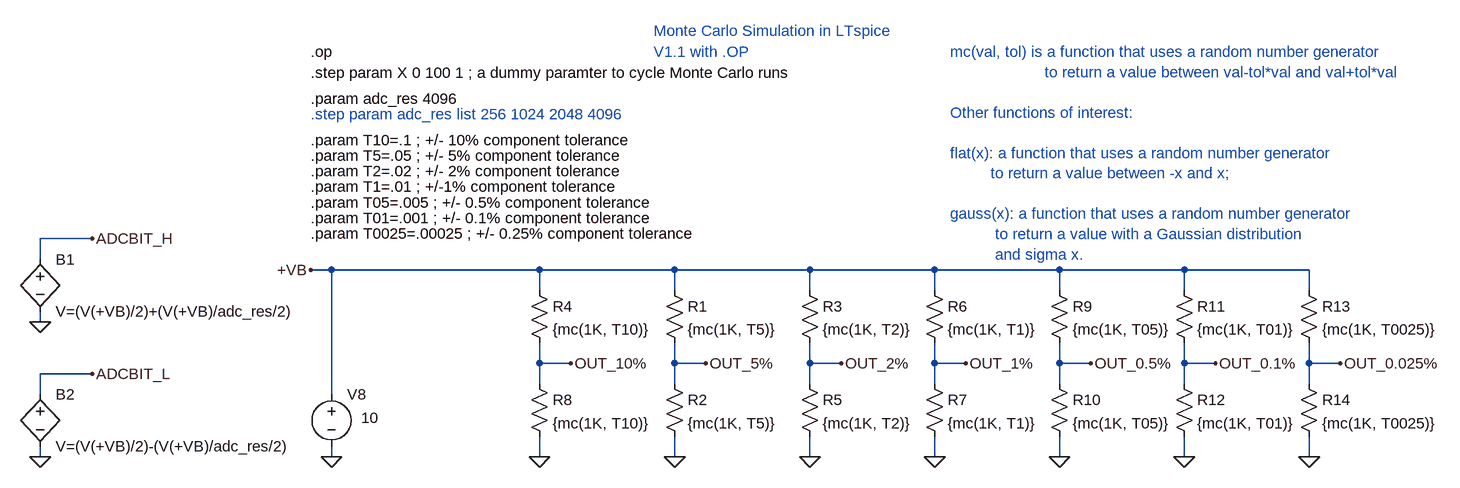
[diagram p0: schematic Voltage Divider Tol vs ADC Resolution V1.1.asc]
Voltage Divider Tol vs ADC Resolution V1.1.asc, the LTspice schematic file:
Version 4
SHEET 1 1944 2380
WIRE -2032 784 -2112 784
WIRE -2112 816 -2112 784
WIRE -1664 832 -1696 832
WIRE -1344 832 -1664 832
WIRE -1136 832 -1344 832
WIRE -928 832 -1136 832
WIRE -736 832 -928 832
WIRE -544 832 -736 832
WIRE -352 832 -544 832
WIRE -160 832 -352 832
WIRE -1344 864 -1344 832
WIRE -1136 864 -1136 832
WIRE -928 864 -928 832
WIRE -736 864 -736 832
WIRE -544 864 -544 832
WIRE -352 864 -352 832
WIRE -160 864 -160 832
WIRE -2112 912 -2112 896
WIRE -1344 976 -1344 944
WIRE -1296 976 -1344 976
WIRE -1136 976 -1136 944
WIRE -1088 976 -1136 976
WIRE -928 976 -928 944
WIRE -880 976 -928 976
WIRE -736 976 -736 944
WIRE -688 976 -736 976
WIRE -544 976 -544 944
WIRE -496 976 -544 976
WIRE -352 976 -352 944
WIRE -304 976 -352 976
WIRE -160 976 -160 944
WIRE -112 976 -160 976
WIRE -2032 992 -2112 992
WIRE -1344 1008 -1344 976
WIRE -1136 1008 -1136 976
WIRE -928 1008 -928 976
WIRE -736 1008 -736 976
WIRE -544 1008 -544 976
WIRE -352 1008 -352 976
WIRE -160 1008 -160 976
WIRE -2112 1024 -2112 992
WIRE -1664 1024 -1664 832
WIRE -2112 1120 -2112 1104
WIRE -1664 1120 -1664 1104
WIRE -1344 1120 -1344 1088
WIRE -1136 1120 -1136 1088
WIRE -928 1120 -928 1088
WIRE -736 1120 -736 1088
WIRE -544 1120 -544 1088
WIRE -352 1120 -352 1088
WIRE -160 1120 -160 1088
FLAG -1696 832 +VB
FLAG -1664 1120 0
FLAG -1344 1120 0
FLAG -1296 976 OUT_10%
FLAG -1136 1120 0
FLAG -1088 976 OUT_5%
FLAG -928 1120 0
FLAG -880 976 OUT_2%
FLAG -736 1120 0
FLAG -688 976 OUT_1%
FLAG -544 1120 0
FLAG -496 976 OUT_0.5%
FLAG -352 1120 0
FLAG -304 976 OUT_0.1%
FLAG -160 1120 0
FLAG -112 976 OUT_0.025%
FLAG -2112 912 0
FLAG -2112 1120 0
FLAG -2032 784 ADCBIT_H
FLAG -2032 992 ADCBIT_L
SYMBOL VOLTAGE -1664 1008 R0
WINDOW 123 34 85 Left 0
WINDOW 39 71 17 Left 0
WINDOW 3 46 52 Left 0
SYMATTR Value 10
SYMATTR InstName V8
SYMBOL res -1360 848 R0
SYMATTR InstName R4
SYMATTR Value {mc(1K, T10)}
SYMBOL res -1360 992 R0
SYMATTR InstName R8
SYMATTR Value {mc(1K, T10)}
SYMBOL res -1152 848 R0
SYMATTR InstName R1
SYMATTR Value {mc(1K, T5)}
SYMBOL res -1152 992 R0
SYMATTR InstName R2
SYMATTR Value {mc(1K, T5)}
SYMBOL res -944 848 R0
SYMATTR InstName R3
SYMATTR Value {mc(1K, T2)}
SYMBOL res -944 992 R0
SYMATTR InstName R5
SYMATTR Value {mc(1K, T2)}
SYMBOL res -752 848 R0
SYMATTR InstName R6
SYMATTR Value {mc(1K, T1)}
SYMBOL res -752 992 R0
SYMATTR InstName R7
SYMATTR Value {mc(1K, T1)}
SYMBOL res -560 848 R0
SYMATTR InstName R9
SYMATTR Value {mc(1K, T05)}
SYMBOL res -560 992 R0
SYMATTR InstName R10
SYMATTR Value {mc(1K, T05)}
SYMBOL res -368 848 R0
SYMATTR InstName R11
SYMATTR Value {mc(1K, T01)}
SYMBOL res -368 992 R0
SYMATTR InstName R12
SYMATTR Value {mc(1K, T01)}
SYMBOL res -176 848 R0
SYMATTR InstName R13
SYMATTR Value {mc(1K, T0025)}
SYMBOL res -176 992 R0
SYMATTR InstName R14
SYMATTR Value {mc(1K, T0025)}
SYMBOL bv -2112 800 R0
SYMATTR InstName B1
SYMATTR Value V=(V(+VB)/2)+(V(+VB)/adc_res/2)
SYMBOL bv -2112 1008 R0
SYMATTR InstName B2
SYMATTR Value V=(V(+VB)/2)-(V(+VB)/adc_res/2)
TEXT -1696 496 Left 0 !.op
TEXT -1696 528 Left 0 !.step param X 0 100 1 ; a dummy paramter to cycle Monte Carlo runs
TEXT -1696 656 Left 0 !.param T5=.05 ; +/- 5% component tolerance
TEXT -712 496 Left 0 ;mc(val, tol) is a function that uses a random number generator \n                     to return a value between val-tol*val and val+tol*val\n \nOther functions of interest:\n \nflat(x): a function that uses a random number generator \n         to return a value between -x and x;\n \ngauss(x): a function that uses a random number generator \n          to return a value with a Gaussian distribution\n          and sigma x.
TEXT -1696 632 Left 0 !.param T10=.1 ; +/- 10% component tolerance
TEXT -1696 680 Left 0 !.param T2=.02 ; +/- 2% component tolerance
TEXT -1696 704 Left 0 !.param T1=.01 ; +/-1% component tolerance
TEXT -1696 728 Left 0 !.param T05=.005 ; +/- 0.5% component tolerance
TEXT -1696 752 Left 0 !.param T01=.001 ; +/- 0.1% component tolerance
TEXT -1696 776 Left 0 !.param T0025=.00025 ; +/- 0.25% component tolerance
TEXT -1696 568 Left 0 !.param adc_res 4096
TEXT -1696 592 Left 0 ;.step param adc_res list 256 1024 2048 4096
TEXT -1168 464 Left 0 ;Monte Carlo Simulation in LTspice
TEXT -1168 496 Left 0 ;V1.1 with .OP

The netlist it stands for:
* Voltage Divider Tol vs ADC Resolution V1.1.asc
V8 +VB 0 10
R4 +VB OUT_10% {mc(1K, T10)}
R8 OUT_10% 0 {mc(1K, T10)}
R1 +VB OUT_5% {mc(1K, T5)}
R2 OUT_5% 0 {mc(1K, T5)}
R3 +VB OUT_2% {mc(1K, T2)}
R5 OUT_2% 0 {mc(1K, T2)}
R6 +VB OUT_1% {mc(1K, T1)}
R7 OUT_1% 0 {mc(1K, T1)}
R9 +VB OUT_0.5% {mc(1K, T05)}
R10 OUT_0.5% 0 {mc(1K, T05)}
R11 +VB OUT_0.1% {mc(1K, T01)}
R12 OUT_0.1% 0 {mc(1K, T01)}
R13 +VB OUT_0.025% {mc(1K, T0025)}
R14 OUT_0.025% 0 {mc(1K, T0025)}
B1 ADCBIT_H 0 V=(V(+VB)/2)+(V(+VB)/adc_res/2)
B2 ADCBIT_L 0 V=(V(+VB)/2)-(V(+VB)/adc_res/2)
.op
.step param X 0 100 1 ; a dummy paramter to cycle Monte Carlo runs
.param T5=.05 ; +/- 5% component tolerance
* mc(val, tol) is a function that uses a random number generator
*                      to return a value between val-tol*val and val+tol*val
* Other functions of interest:
* flat(x): a function that uses a random number generator
*          to return a value between -x and x;
* gauss(x): a function that uses a random number generator
*           to return a value with a Gaussian distribution
*           and sigma x.
.param T10=.1 ; +/- 10% component tolerance
.param T2=.02 ; +/- 2% component tolerance
.param T1=.01 ; +/-1% component tolerance
.param T05=.005 ; +/- 0.5% component tolerance
.param T01=.001 ; +/- 0.1% component tolerance
.param T0025=.00025 ; +/- 0.25% component tolerance
.param adc_res 4096
* .step param adc_res list 256 1024 2048 4096
* Monte Carlo Simulation in LTspice
* V1.1 with .OP
.backanno
.end